# Altium schematic sheet SMPS_3V3.SchDoc
size Letter
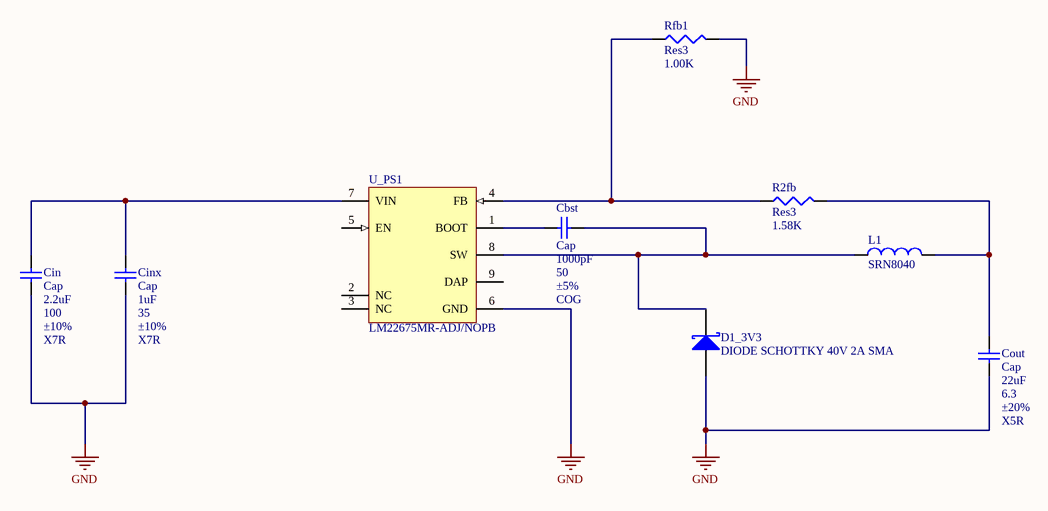
[diagram p0: SMPS_3V3.SchDoc]

## Parts
Cbst  Cap  value 1000pF  WV: 50  Tolerance: ±5%  Type: COG  [CAPC2012X09M]
Cin  Cap  value 2.2uF  WV: 100  Tolerance: ±10%  Type: X7R  [C1210]
Cinx  Cap  value 1uF  WV: 35  Tolerance: ±10%  Type: X7R  [CAPC2012X09M]
Cout  Cap  value 22uF  WV: 6.3  Tolerance: ±20%  Type: X5R  [CAPC2012X09M]
D1_3V3  DIODE SCHOTTKY 40V 2A SMA  [DIOM4326X23M]
L1  SRN8040  [INDP8080X40M]
R2fb  Res3  value 1.58K  [RESC2112X05M]
Rfb1  Res3  value 1.00K  [RESC2112X05M]
U_PS1  LM22675MR-ADJ/NOPB  [MRA08B_L]

## Nets
GND: Cin.1 Cinx.1 Cout.1 D1_3V3.2(A) Rfb1.2 U_PS1.6(GND)
NetCbst_1: Cbst.1 U_PS1.1(BOOT)
NetCbst_2: Cbst.2 D1_3V3.1(K) L1.1 U_PS1.8(SW)
NetCin_2: Cin.2 Cinx.2 U_PS1.7(VIN)
NetCout_2: Cout.2 L1.2 R2fb.2
NetR2fb_1: R2fb.1 Rfb1.1 U_PS1.4(FB)

Not connected (* = marked no-connect by the designer): U_PS1 2(NC) 3(NC) 5(EN) 9(DAP)

## Notes on the sheet
- Title
- Size:
- Date:
- Letter
- Number:
- Time:
- Revision:
- Sheet
- of
- File:

## Library data of the parts
Cbst = CAP-COG-1000pF-50V-±5%: CAP CER 1000pF 50v COG 0805; MPN: C0805C102J5GACTU; PN: 399-1136-1-ND; Name: CAP-COG-1000pF-50V-±5%; URL: http://www.digikey.ca/product-detail/en/C0805C102J5GACTU/399-1136-1-ND
Cin = CAP-X7R-2.2uF-16V-±10%: CAP CER 2.2uF 100v X7R 1210; MPN: C0805C225K4RACTU; Name: CAP-X7R-2.2uF-100V-±10%; PN: 399-3523-1-ND; URL: http://www.digikey.ca/product-detail/en/C3225X7R2A225K230AB/445-4497-1-ND/2042293
Cinx = CAP-X7R-1uF-16V-±10%: CAP CER 1uF 35v X7R 0805; MPN: C0805C105K4RACTU; PN: 587-1438-1-ND; Name: CAP-X7R-1uF-16V-±10%; URL: http://www.digikey.ca/product-detail/en/GMK212B7105KG-T/587-1438-1-ND/1004069
Cout = CAP-X5R-22uF-6.3V-±20%: CAP CER 22uF 6.3v X5R 0805; MPN: C0805C226M9PACTU; PN: 399-4696-1-ND; Name: CAP-X5R-22uF-6.3V-±20%; URL: http://www.digikey.ca/product-detail/en/C0805C226M9PACTU/399-4696-1-ND
D1_3V3 = DIODE SCHOTTKY 40V 2A SMA: Schottky Rectifier; MPN: B240A-13-F; PN: B240A-FDICT-ND; URL: http://www.digikey.ca/product-detail/en/B240A-13-F/B240A-FDICT-ND
L1 = SRN8040: FIXED IND 22UH 2.2A 100 MOHM SMD; MPN: SRN8040-220M; PN: SRN8040-220MCT-ND; URL: http://www.digikey.ca/product-detail/en/SRN8040-220M/SRN8040-220MCT-ND
R2fb = Resistor_1.58K: RES SMD 1.58K OHM 1% 1/8W 0805; MPN: CRCW08051K58FKEA; PN: 541-1580KCCT-ND; Name: Resistor_1.58K; URL: http://www.digikey.ca/product-detail/en/CRCW08051K58FKEA/541-1580KCCT-ND
Rfb1 = Resistor_1.00K: RES SMD 1.00K OHM 1% 1/8W 0805; MPN: CRCW08051K00FKEA; PN: 541-1000KCCT-ND; Name: Resistor_1.00K; URL: http://www.digikey.ca/product-detail/en/CRCW08051K00FKEA/541-1000KCCT-ND
U_PS1 = LM22675MR-ADJ/NOPB: 1A SIMPLE SWITCHER®, Step-Down Voltage Regulator with Precision Enable, 8-pin PSOP, Pb-Free; Manufacturer: National Semiconductor; MPN: LM22675MRE-ADJ/NOPB; PackageTopMarking: NSXYTT*L22675*ADJ; PowerWise: N; High-Reliability: Y; PN: LM22675MRE-ADJ/NOPBCT-ND; DatasheetVersion: Dec-2010; PackageVersion: revB, Dec-2007; PackageReference: MRA08B; PackageDescription: Molded, PSOP .193 x .154 x .058in, 8 Lead, .050in Pitch, Large DAP; PartNumber: LM22675MR-ADJ/NOPB; RoHS: Y; PinCount: 8; CompType: Switcher; Code_JEDEC: MS-012-AA; ComponentLink1Description: Manufacturer URL; ComponentLink1URL: http://www.national.com/; ComponentLink2Description: LM22675 Datasheet; ComponentLink2URL: http://www.national.com/ds/LM/LM22675.pdf; ComponentLink3Description: LM22675 Web Page; ComponentLink3URL: http://www.national.com/pf/LM/LM22675.html; ComponentLink4Description: MRA08B Package Page; ComponentLink4URL: http://www.national.com/packaging/folders/mra08b.html; URL: http://www.digikey.ca/product-detail/en/LM22675MRE-ADJ%2FNOPB/LM22675MRE-ADJ%2FNOPBCT-ND